# Altium project c195-group-9-vocast-pcb.PrjPcb (part 2 of 2)

## Sheet ESP32.SchDoc
size A; SheetNumber: 3; SheetTotal: 5
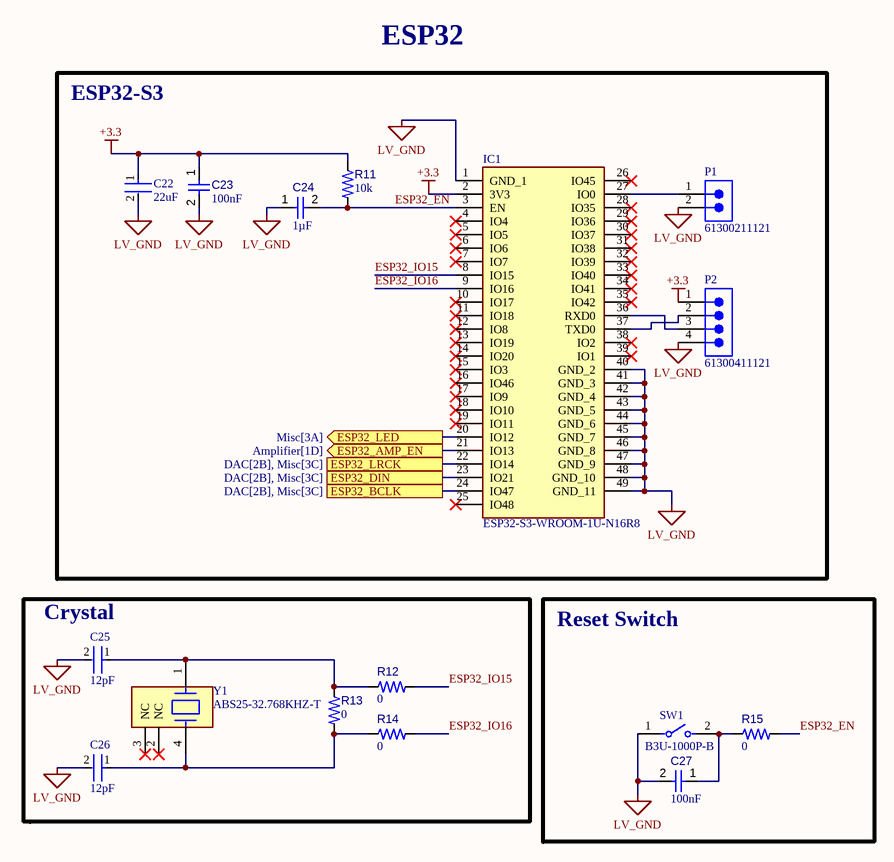
[diagram p2: ESP32.SchDoc]

### Parts
C22  22uF  [FP-GRM188-0_2-IPC_C]
C23  value 100nF  [FP-0603-L_1_6_0_15-W_0_81-IPC_C]  (hidden comment: 06035C104K4T2A)
C24  value 1µF  [CAPC0603(1608)100_L]  (hidden comment: Capacitor 1µF +/-0.1% 25V 0603)
C25  12pF  [FP-C0603C-CF-MFG]
C26  12pF  [FP-C0603C-CF-MFG]
C27  value 100nF  [FP-0603-L_1_6_0_15-W_0_81-IPC_C]  (hidden comment: 06035C104K4T2A)
IC1  ESP32-S3-WROOM-1U-N16R8  [ESP32S3WROOM1UN16R8]
P1  61300211121  [61300211121]
P2  61300411121  [61300411121]
R11  value 10k  [FP-CRCW0603-e3-IPC_C]  (hidden comment: CRCW060310K0JNEA)
R12  value 0  [RESC0603(1608)_L]  (hidden comment: Jumper 0603)
R13  value 0  [RESC0603(1608)_L]  (hidden comment: Jumper 0603)
R14  value 0  [RESC0603(1608)_L]  (hidden comment: Jumper 0603)
R15  value 0  [RESC0603(1608)_L]  (hidden comment: Jumper 0603)
SW1  B3U-1000P-B  [FP-B3U-1000P-B-MFG]
Y1  ABS25-32.768KHZ-T  [FP-ABS25-MFG]

### Blocks framed on the sheet
ESP32-S3: C22-C24 IC1 P1 P2 R11
Crystal: C25 C26 R12-R14 Y1
Reset Switch: C27 R15 SW1

### Ports
ESP32_AMP_EN (out, see Amplifier[1D]), ESP32_BCLK (see DAC[2B], Misc[3C]), ESP32_DIN (see DAC[2B], Misc[3C]), ESP32_LED (out, see Misc[3A]), ESP32_LRCK (see DAC[2B], Misc[3C])

### Nets
+3.3: C22.1 C23.1 IC1.2(3V3) P2.1 R11.1
LV_GND: C22.2 C23.2 C24.1 C25.2 C26.2 C27.2 IC1.1(GND_1) IC1.40(GND_2) IC1.41(GND_3) IC1.42(GND_4) IC1.43(GND_5) IC1.44(GND_6) IC1.45(GND_7) IC1.46(GND_8) IC1.47(GND_9) IC1.48(GND_10) IC1.49(GND_11) P1.2 P2.4 SW1.1  [project net TPA311_AGND]
ESP32_EN: C24.2 IC1.3(EN) R11.2 R15.2
ESP32_IO15: IC1.8(IO15) R12.2
ESP32_IO16: IC1.9(IO16) R14.2
NetC25_1: C25.1 R12.1 R13.1 Y1.1
NetC26_1: C26.1 R13.2 R14.1 Y1.4
NetC27_1: C27.1 R15.1 SW1.2
NetIC1_20: IC1.20(IO12) ; port ESP32_LED
NetIC1_21: IC1.21(IO13) ; port ESP32_AMP_EN
NetIC1_22: IC1.22(IO14) ; port ESP32_LRCK
NetIC1_23: IC1.23(IO21) ; port ESP32_DIN
NetIC1_24: IC1.24(IO47) ; port ESP32_BCLK
NetIC1_27: IC1.27(IO0) P1.1
NetIC1_36: IC1.36(RXD0) P2.3
NetIC1_37: IC1.37(TXD0) P2.2

Not connected (* = marked no-connect by the designer): IC1 4(IO4)* 5(IO5)* 6(IO6)* 7(IO7)* 10(IO17)* 11(IO18)* 12(IO8)* 13(IO19)* 14(IO20)* 15(IO3)* 16(IO46)* 17(IO9)* 18(IO10)* 19(IO11)* 25(IO48)* 26(IO45)* 28(IO35)* 29(IO36)* 30(IO37)* 31(IO38)* 32(IO39)* 33(IO40)* 34(IO41)* 35(IO42)* 38(IO2)* 39(IO1)*; Y1 2(NC)* 3(NC)*

### Notes on the sheet
- ESP32

### Library data of the parts
C22 = CMP-2000-06337-3: Chip Multilayer Ceramic Capacitors for General Purpose, 0603, 22uF, X5R, 15%, 20%, 10V; Tolerance: 20%; Weight: 0.000222oz; Material: Ceramic; Depth: 0.8mm; Length: 1.6mm; Termination: SMD/SMT; Capacitance: 22uF; Packaging: Tape and Reel; Width: 0.8mm; Voltage Rating: 10V; Case Code (Imperial): 0603; Mount: Surface Mount; Voltage Rating (DC): 10V; Case/Package: 0603; Thickness: 0.039inch; REACH SVHC: No SVHC; Dielectric: X5R; Height: 0.8mm; Package Quantity: 4000; Case Code (Metric): 1608; Min Operating Temperature: -55°C; Lead Free: Lead Free; Max Operating Temperature: 85°C
C23 C27 = CMP-001-00085-1: Ceramic Capacitor, Multilayer, Ceramic, 50V, 10% +Tol, 10% -Tol, X7R, 15% TC, 0.1uF, Surface Mount, 0603; RoHS Compliant: Yes; Pins: 2; Capacitor Type: Ceramic; Min Operating Temperature: -55°C; Case/Package: 0603; Mounting Technology: Surface Mount; Max Operating Temperature: 125°C
C24 = CMP-001-00055-4: Chip Capacitor, 1µF +/-0.1%, 25V, 0603, Thickness 1 mm; Tolerance: 20%; Min Operating Temperature: -55°C; Max Operating Temperature: 85°C; Voltage Rating: 25V; Mounting Technology: SMT; Case/Package: 0603; Pins: 2
C25 C26 = CMP-2006-03703-3: Ceramic Capacitor 12Pf 50V, C0G, 5%, 0603, Full Reel; Manufacturer: KEMET; Manufacturer Part Number: C0603C120J5GACTU; Automotive Grade: Grade 1; Temperature Coefficient: 30ppm/°C; Tolerance: 0.05; Temperature Range High: +125°C; Temperature Characteristic: C0G; Temperature Range Low: -55°C; Voltage Rating: 50 V; Mouser Description: Ceramic Capacitor 12Pf 50V, C0G, 5%, 0603, Full Reel; Package: C0603C-CF; Temperature: -55°C to +125°C; Device Class L3: Ceramic Capacitors; Value: 12 pF; Material: Ceramic; Lead Free: Yes; ComponentLink2URL: https://api.kemet.com/component-edge/download/datasheet/C0603C100J5GACAUTO.pdf; Category: Cap; Capacitance: 12 pF; ComponentLink2Description: Datasheet; Device Class L1: Passive Components; Height: 0.87mm; Device Class L2: Capacitors; Digikey Description: Ceramic Capacitor 12Pf 50V, C0G, 5%, 0603, Full Reel; RoHS: TRUE; Octopart: https://octopart.com/c0603c120j5gactu-kemet-108780; Automotive: Yes
IC1 = ESP32-S3-WROOM-1U-N16R8: Integrated Circuit; Manufacturer_Name: Espressif Systems; Datasheet Link: https://www.espressif.com/sites/default/files/documentation/esp32-s3-wroom-1_wroom-1u_datasheet_en.pdf; Height: 3.35mm; Manufacturer_Part_Number: ESP32-S3-WROOM-1U-N16R8; Mouser Part Number: 356-ESP32S3WM1UN16R8; Mouser Price/Stock: https://www.mouser.co.uk/ProductDetail/Espressif-Systems/ESP32-S3-WROOM-1U-N16R8?qs=Li%252BoUPsLEns6V0Pr5KRJtw%3D%3D
P1 = CMP-1712-00002-6: NexarPartId: 20081794; Number of Contacts: 2; Pitch: 2.54mm; Connector Type: Male Pin; Voltage Rating: 250V; Current Rating: 3A; Gender: Male; Contact Resistance: 20mΩ; Height: 8.94mm; Lead Free: Lead Free; Number of Pins: 2; Termination: Through Hole; RoHS: Compliant; Lead Pitch: 2.54mm; REACH SVHC: No SVHC; Housing Material: PBT; Contact Mating Length: 5.9944mm; Min Operating Temperature: -40°C; Orientation: Vertical; Contact Material: Copper; Contact Gender: Male; Max Operating Temperature: 125°C; Number of Rows: 1; Number of Positions: 2; Packaging: Bulk; Contact Plating: Gold; Mount: Through Hole; Color: Black; Operating Supply Voltage: 250V
P2 = CMP-1502-01064-3: NexarPartId: 32855522; Operating Supply Voltage: 250V; Pitch: 2.54mm; Contact Resistance: 20mΩ; Number of Positions: 4; Current Rating: 3A; Connector Type: Male Pin; Gender: Male; Contact Plating: Gold; Height: 8.89mm; Lead Pitch: 2.54mm; Lead Free: Lead Free; Contact Mating Length: 5.9944mm; Number of Rows: 1; Termination: Solder; Packaging: Bulk; REACH SVHC: Unknown; Min Operating Temperature: -40°C; RoHS: Compliant; Number of Contacts: 4; Voltage Rating: 250V; Color: Black; Max Operating Temperature: 105°C; Contact Material: Copper; Mount: Through Hole; Orientation: Vertical; Number of Pins: 4
R11 = CMP-009-00197-4: Fixed Resistor, Metal Glaze/thick Film, 0.1W, 10000ohm, 75V, 5% +/-Tol, 200ppm/Cel, Surface Mount, 0603; Power: 100mW; Mounting Technology: Surface Mount; Tolerance: 5%; RoHS Compliant: Yes; Pins: 2; Max Operating Temperature: 155°C; Min Operating Temperature: -55°C; Case/Package: 0603
R12-R15 = CMP-009-00175-6: Pins: 2; Case/Package: 0603; Min Operating Temperature: -55°C; Max Operating Temperature: 155°C
SW1 = CMP-08834-000005-1: SWITCH TACTILE SPST-NO 0.05A 12V; Manufacturer: Omron; Operating Force: 1.5N; Contact Current Rating: 50mA; Contact Resistance: 100mΩ; Electromechanical Life: 200000Cycles; Height: 1.75mm; Device Class L2: Switches; Temperature Range High: +70°C; Digikey Description: SWITCH TACTILE SPST-NO 0.05A 12V; Throw Configuration: SPST-NO; Ambient Temperature Range High: +70°C; Temperature: -25°C to +70°C; Lead Free: Yes; ComponentLink2URL: https://omronfs.omron.com/en_US/ecb/products/pdf/en-b3u.pdf; Device Class L3: Tactile Switches; Manufacturer Part Number: B3U-1000P-B; Ambient Temperature Range Low: -25°C; Mount: Surface Mount; Automotive: No; Mouser Description: Tactile Switches Top Actuated with boss w/o ground; Octopart: https://octopart.com/b3u-1000p-b-omron-1057356; RoHS: TRUE; Package: 0; Device Class L1: Electromechanical; Voltage Rating Dc: 12V; Category: Switch; Temperature Range Low: -25°C; ComponentLink2Description: Datasheet
Y1 = CMP-2000-05037-2: CRYSTAL 32.7680KHZ 12.5PF SMD; ESR (Equivalent Series Resistance): 50kR; Tolerance: 20ppm; Width: 3.8mm; REACH SVHC: No SVHC; Load Capacitance: 12.5pF; Case/Package: SMD/SMT; Radiation Hardening: No; Series: ABS25; Number of Pins: 4; Mount: Surface Mount; RoHS Compliant: Yes; Packaging: Tape and Reel; Termination: SMD/SMT; Frequency Tolerance: 20ppm; Lead Free: Lead Free; Package Quantity: 1000; Min Operating Temperature: -40°C; Height: 0.098inch; Length: 8mm; Frequency: 32.768kHz; Max Operating Temperature: 85°C; Series Resistance: 50kR; Operating Frequency: 32.768 kHz; Depth: 3.8mm

## Sheet DAC.SchDoc
size A; SheetNumber: 4; SheetTotal: 5
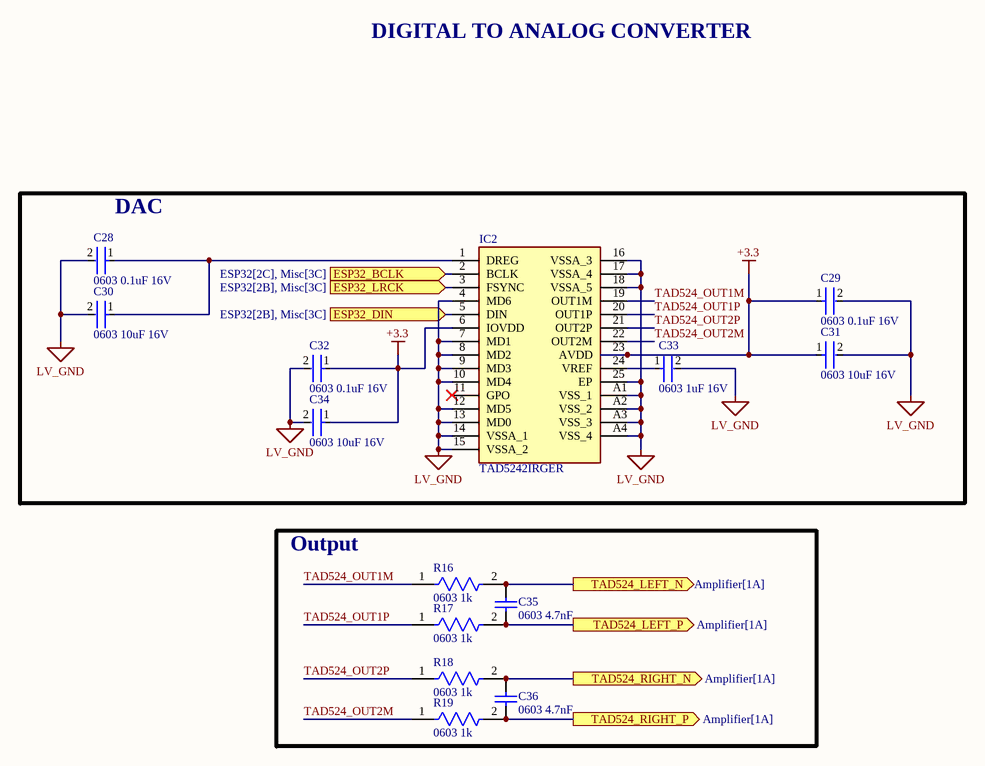
[diagram p3: DAC.SchDoc]

### Parts
C28  0603 0.1uF 16V  [FP-CC0603-DA-MFG]
C29  0603 0.1uF 16V  [FP-CC0603-DA-MFG]
C30  0603 10uF 16V  [FP-0603-L_1_6_0_2-W_0_8_0-MFG]
C31  0603 10uF 16V  [FP-0603-L_1_6_0_2-W_0_8_0-MFG]
C32  0603 0.1uF 16V  [FP-CC0603-DA-MFG]
C33  0603 1uF 16V  [FP-CC0603-DA-MFG]
C34  0603 10uF 16V  [FP-0603-L_1_6_0_2-W_0_8_0-MFG]
C35  0603 4.7nF  [CAPC1608X90X35ML10T15]
C36  0603 4.7nF  [CAPC1608X90X35ML10T15]
IC2  TAD5242IRGER  [TAD5242IRGER]
R16  0603 1k  [FP-AC0603-IPC_B]
R17  0603 1k  [FP-AC0603-IPC_B]
R18  0603 1k  [FP-AC0603-IPC_B]
R19  0603 1k  [FP-AC0603-IPC_B]

### Blocks framed on the sheet
DAC: C28-C34 IC2
Output: C35 C36 R16-R19

### Ports
ESP32_BCLK (in, see ESP32[2C], Misc[3C]), ESP32_DIN (in, see ESP32[2B], Misc[3C]), ESP32_LRCK (in, see ESP32[2B], Misc[3C]), TAD524_LEFT_N (out, see Amplifier[1A]), TAD524_LEFT_P (out, see Amplifier[1A]), TAD524_RIGHT_N (out, see Amplifier[1A]), TAD524_RIGHT_P (out, see Amplifier[1A])

### Nets
+3.3: C29.1 C31.1 C32.1 C34.1 IC2.6(IOVDD) IC2.23(AVDD)
LV_GND: C28.2 C29.2 C30.2 C31.2 C32.2 C33.2 C34.2 IC2.4(MD6) IC2.7(MD1) IC2.8(MD2) IC2.9(MD3) IC2.10(MD4) IC2.12(MD5) IC2.13(MD0) IC2.14(VSSA_1) IC2.15(VSSA_2) IC2.16(VSSA_3) IC2.17(VSSA_4) IC2.18(VSSA_5) IC2.25(EP) IC2.A1(VSS_1) IC2.A2(VSS_2) IC2.A3(VSS_3) IC2.A4(VSS_4)  [project net TPA311_AGND]
TAD524_OUT1M: IC2.19(OUT1M) R16.1
TAD524_OUT1P: IC2.20(OUT1P) R17.1
TAD524_OUT2M: IC2.22(OUT2M) R19.1
TAD524_OUT2P: IC2.21(OUT2P) R18.1
NetC1_1: C35.2 R17.2 ; port TAD524_LEFT_P
NetC3_1: C35.1 R16.2 ; port TAD524_LEFT_N
NetC5_1: C36.2 R19.2 ; port TAD524_RIGHT_P
NetC6_1: C36.1 R18.2 ; port TAD524_RIGHT_N
NetC28_1: C28.1 C30.1 IC2.1(DREG)
NetC33_1: C33.1 IC2.24(VREF)
NetIC1_22: IC2.3(FSYNC) ; port ESP32_LRCK
NetIC1_23: IC2.5(DIN) ; port ESP32_DIN
NetIC1_24: IC2.2(BCLK) ; port ESP32_BCLK

Not connected (* = marked no-connect by the designer): IC2 11(GPO)*

### Notes on the sheet
- DIGITAL TO ANALOG CONVERTER

### Library data of the parts
C28 C29 C32 = CMP-2000-05002-2: CAP CER 0.1UF 16V X7R 0603; Manufacturer Part Number: CC0603KRX7R7BB104; Manufacturer: YAGEO; Tolerance: 0.1; Value: 100 nF; Temperature Coefficient: 15%; Material: Ceramic; Voltage Rating: 16 V; Package: CC0603-DA; ComponentLink2Description: Datasheet; Octopart: https://octopart.com/cc0603krx7r7bb104-yageo-192941; Temperature Range High: +125°C; Digikey Description: CAP CER 0.1UF 16V X7R 0603; Voltage: 16 V; Device Class L2: Capacitors; Height: 0.9mm; Temperature: -55°C to +125°C; Device Class L1: Passive Components; Device Class L3: Ceramic Capacitors; ComponentLink2URL: http://www.yageo.com/documents/recent/UPY-GPHC_X7R_6.3V-to-50V_18.pdf; Footprint Url: http://www.yageo.com/exep/pages/download/literatures/UPY-C_GEN_24.pdf; RoHS: TRUE; Temperature Range Low: -55°C; Temperature Characteristic: X7R; Lead Free: Yes; Capacitance: 100 nF; Category: Cap; Mouser Description: Multilayer Ceramic Capacitor, CC Series, 0.1 - F, - 10%, X7R, 16 V, 0603 [1608 Metric]; Automotive: No
C30 C31 C34 = CMP-2000-06226-4: Multilayer Ceramic Capacitor 10uF 16V X5R 20% SMD 0603 T/R; Packaging: Tape and Reel; Construction: Flat; Height: 0.8mm; Max Operating Temperature: 85°C; Dielectric: X5R; Case Code (Metric): 1608; Voltage Rating (DC): 16V; Width: 0.031inch; Voltage Rating: 16V; Length: 0.063inch; RoHS Compliant: Yes; Halogen Free: Halogen Free; Case Code (Imperial): 0603; Capacitance: 10uF; Mount: Surface Mount; Thickness: 0.031inch; Tolerance: 20%; Min Operating Temperature: -55°C; Series: M; Termination: SMD/SMT; Case/Package: 0603; Package Quantity: 1
C33 = CMP-03422-000924-1: CAP CER 1UF 16V X7R 0603; Manufacturer: YAGEO; Manufacturer Part Number: CC0603KRX7R7BB105; Tolerance: 0.1; Temperature Coefficient: 15%; Material: Ceramic; Package: CC0603-DA; RoHS: TRUE; Device Class L2: Capacitors; Temperature Characteristic: X7R; Temperature: -55°C to +125°C; Temperature Range Low: -55°C; Automotive: No; ComponentLink2Description: Datasheet; Value: 1 uF; Lead Free: Yes; Capacitance: 1 uF; ComponentLink2URL: http://www.yageo.com/documents/recent/UPY-GPHC_X7R_6.3V-to-50V_18.pdf; Device Class L1: Passive Components; Voltage: 16 V; Octopart: https://octopart.com/cc0603krx7r7bb105-yageo-42271928; Category: Cap; Digikey Description: CAP CER 1UF 16V X7R 0603; Footprint Url: http://www.yageo.com/exep/pages/download/literatures/UPY-C_GEN_24.pdf; Height: 0.9mm; Voltage Rating: 16 V; Temperature Range High: +125°C; Mouser Description: Multilayer Ceramic Capacitor, CC Series, 1 - F, - 10%, X7R, 16 V, 0603 [1608 Metric]; Device Class L3: Ceramic Capacitors
C35 C36 = CMP-2006-02924-1: Part Number: GRM188R71H472KA01D; Manufacturer: Murata
IC2 = TAD5242IRGER: Integrated Circuit; Manufacturer_Name: Texas Instruments; Datasheet Link: https://www.ti.com/lit/ds/symlink/tad5242.pdf?ts=1736249226355&ref_url=https%253A%252F%252Fwww.ti.com%252Fproduct%252FTAD5242; Height: 1mm; Manufacturer_Part_Number: TAD5242IRGER; Mouser Part Number: 595-TAD5242IRGER; Mouser Price/Stock: https://www.mouser.co.uk/ProductDetail/Texas-Instruments/TAD5242IRGER?qs=%252BXxaIXUDbq07iiss%252B1zA7A%3D%3D
R16-R19 = CMP-2000-04828-3: RES 1kΩ 1.00% 0.1W 0603; Voltage Rating: 50V; Power Rating: 100mW; Tolerance: 1%; Temperature Coefficient: 100ppm/°C; Resistance: 1kR; Depth: 0.8mm; Case/Package: 0603; Size Code: 0603; Case Code (Metric): 1608; Height: 0.022inch; Series: AC; Width: 0.031inch; Construction: Rectangular; Length: 0.063inch; Case Code (Imperial): 0603; Package Quantity: 1; RoHS Compliant: Yes; Features: Moisture Resistant; Resistor Type: Thick Film; Max Power Dissipation: 100mW; Packaging: Tape and Reel; Termination: SMD/SMT; Ratings: AEC-Q200; Max Operating Temperature: 155°C; Min Operating Temperature: -55°C; Military Standard: Not; Lead Free: Lead Free; Number of Terminations: 2

## Sheet Amplifier.SchDoc
size A; SheetNumber: 5; SheetTotal: 5
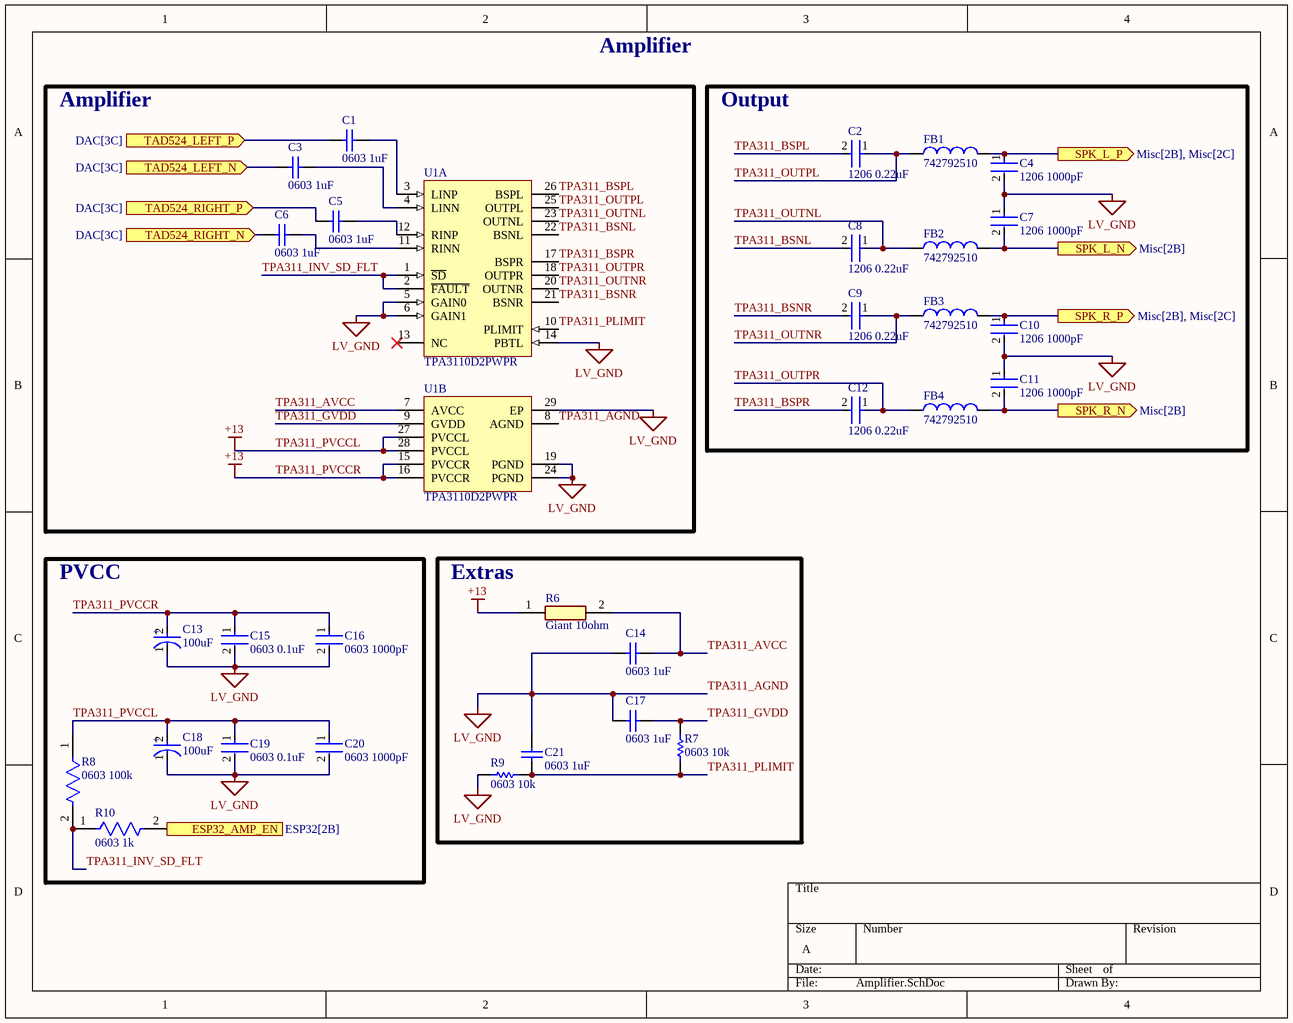
[diagram p4: Amplifier.SchDoc]

### Parts
C1  0603 1uF  [CAPC1608X87X35LL15T15]
C2  1206 0.22uF  [FP-C1206C-EB-MFG]
C3  0603 1uF  [CAPC1608X87X35LL15T15]
C4  1206 1000pF  [FP-C1206C-EB-MFG]
C5  0603 1uF  [CAPC1608X87X35LL15T15]
C6  0603 1uF  [CAPC1608X87X35LL15T15]
C7  1206 1000pF  [FP-C1206C-EB-MFG]
C8  1206 0.22uF  [FP-C1206C-EB-MFG]
C9  1206 0.22uF  [FP-C1206C-EB-MFG]
C10  1206 1000pF  [FP-C1206C-EB-MFG]
C11  1206 1000pF  [FP-C1206C-EB-MFG]
C12  1206 0.22uF  [FP-C1206C-EB-MFG]
C13  100uF  [FP-RAD-TH-D_8_0_5-L_11_5-MFG]
C14  0603 1uF  [CAPC1608X87X35LL15T15]
C15  0603 0.1uF  [FP-C0603C-CF-MFG]
C16  0603 1000pF  [FP-C0603C-CF-MFG]
C17  0603 1uF  [CAPC1608X87X35LL15T15]
C18  100uF  [FP-RAD-TH-D_8_0_5-L_11_5-MFG]
C19  0603 0.1uF  [FP-C0603C-CF-MFG]
C20  0603 1000pF  [FP-C0603C-CF-MFG]
C21  0603 1uF  [CAPC1608X87X35LL15T15]
FB1  742792510  [WE-CBF_1812_L4.5W3.2H1.5_HC]
FB2  742792510  [WE-CBF_1812_L4.5W3.2H1.5_HC]
FB3  742792510  [WE-CBF_1812_L4.5W3.2H1.5_HC]
FB4  742792510  [WE-CBF_1812_L4.5W3.2H1.5_HC]
R6  Giant 10ohm  [TO508P350X1040X2030-2P]
R7  0603 10k  [RESC1609X55X30LL15T15]
R8  0603 100k  [FP-RC0603-0_55-MFG]
R9  0603 10k  [RESC1609X55X30LL15T15]
R10  0603 1k  [FP-AC0603-IPC_B]
U1  TPA3110D2PWPR  [TI-PWP28-5720X1950TP_L]  (parts A,B of 2)

### Blocks framed on the sheet
Amplifier: C1 C3 C5 C6 U1
Output: C2 C4 C7-C12 FB1-FB4
PVCC: C13 C15 C16 C18-C20 R8 R10
Extras: C14 C17 C21 R6 R7 R9

### Ports
ESP32_AMP_EN (in, see ESP32[2B]), SPK_L_N (out, see Misc[2B]), SPK_L_P (out, see Misc[2B], Misc[2C]), SPK_R_N (out, see Misc[2B]), SPK_R_P (out, see Misc[2B], Misc[2C]), TAD524_LEFT_N (in, see DAC[3C]), TAD524_LEFT_P (in, see DAC[3C]), TAD524_RIGHT_N (in, see DAC[3C]), TAD524_RIGHT_P (in, see DAC[3C])

### Nets
TPA311_AGND: C4.2 C7.1 C10.2 C11.1 C13.1(C) C14.1 C15.2 C16.2 C17.1 C18.1(C) C19.2 C20.2 C21.1 R9.1 U1.5(GAIN0) U1.6(GAIN1) U1.8(AGND) U1.14(PBTL) U1.19(PGND) U1.24(PGND) U1.29(EP)  [also labelled LV_GND]
TPA311_PVCCL: C13.2(A) C15.1 C16.1 C18.2(A) C19.1 C20.1 R6.1 R8.1 U1.15(PVCCR) U1.16(PVCCR) U1.27(PVCCL) U1.28(PVCCL)  [also labelled +13, TPA311_PVCCR]
TPA311_AVCC: C14.2 R6.2 U1.7(AVCC)
TPA311_BSNL: C8.2 U1.22(BSNL)
TPA311_BSNR: C9.2 U1.21(BSNR)
TPA311_BSPL: C2.2 U1.26(BSPL)
TPA311_BSPR: C12.2 U1.17(BSPR)
TPA311_GVDD: C17.2 R7.1 U1.9(GVDD)
TPA311_INV_SD_FLT: R8.2 R10.1 U1.1(~{SD}) U1.2(~{FAULT})
TPA311_OUTNL: C8.1 FB2.1 U1.23(OUTNL)
TPA311_OUTNR: C9.1 FB3.1 U1.20(OUTNR)
TPA311_OUTPL: C2.1 FB1.1 U1.25(OUTPL)
TPA311_OUTPR: C12.1 FB4.1 U1.18(OUTPR)
TPA311_PLIMIT: C21.2 R7.2 R9.2 U1.10(PLIMIT)
NetC1_1: C1.1 ; port TAD524_LEFT_P
NetC1_2: C1.2 U1.3(LINP)
NetC3_1: C3.1 ; port TAD524_LEFT_N
NetC3_2: C3.2 U1.4(LINN)
NetC4_1: C4.1 FB1.2 ; port SPK_L_P
NetC5_1: C5.1 ; port TAD524_RIGHT_P
NetC5_2: C5.2 U1.12(RINP)
NetC6_1: C6.1 ; port TAD524_RIGHT_N
NetC6_2: C6.2 U1.11(RINN)
NetC7_2: C7.2 FB2.2 ; port SPK_L_N
NetC10_1: C10.1 FB3.2 ; port SPK_R_P
NetC11_2: C11.2 FB4.2 ; port SPK_R_N
NetIC1_21: R10.2 ; port ESP32_AMP_EN

Not connected (* = marked no-connect by the designer): U1 13(NC)*

### Notes on the sheet
- Amplifier
- (in symbol CMP-05427-002079-1) +

### Library data of the parts
C1 C3 C5 C6 C14 C17 C21 = CMP-2006-03713-1: Part Number: C0603C105K3RACTU; Manufacturer: Kemet
C2 C8 C9 C12 = CMP-03020-014280-1: CAP CER 0.22UF 50V X7R 1206; Manufacturer Part Number: C1206C224K5RACTU; Manufacturer: KEMET; Value: 0.22 μF; Automotive Grade: Grade 0; Tolerance: 0.1; Material: Ceramic; Temperature Coefficient: 15%; Octopart: https://octopart.com/c1206c224k5ractu-kemet-99129; Automotive: Yes; ComponentLink2URL: https://content.kemet.com/datasheets/KEM_C1007_X8R_ULTRA_150C_SMD.pdf; Ipc Land Pattern Name: CAPC320160X78; Digikey Description: CAP CER 0.22UF 50V X7R 1206; Voltage Rating: 50 V; RoHS: TRUE; Device Class L3: Ceramic Capacitors; Device Class L2: Capacitors; Device Class L1: Passive Components; Temperature Range Low: -55°C; Temperature: -55°C to +150°C; Temperature Range High: +150°C; ComponentLink2Description: Datasheet; Category: Cap; Height: 0.88mm; Capacitance: 0.22 μF; Temperature Characteristic: X7R; Package: C1206C-EB; Lead Free: Yes
C4 C7 C10 = CMP-03020-011698-1: CAP CER 100PF 100V C0G/NP0 1206; Manufacturer: KEMET; Manufacturer Part Number: C1206C101J1GACTU; Temperature Characteristic: C0G; Temperature Coefficient: 15%; Tolerance: 0.05; Automotive Grade: Grade 0; Material: Ceramic; Temperature Range Low: -55°C; Device Class L3: Ceramic Capacitors; Temperature: -55°C to +150°C; Value: 100 pF; Capacitance: 100 pF; ComponentLink2URL: https://content.kemet.com/datasheets/KEM_C1007_X8R_ULTRA_150C_SMD.pdf; Ipc Land Pattern Name: CAPC320160X78; Mouser Description: Multilayer Ceramic Capacitors MLCC - SMD/SMT 100volts 100pF C0G 5%; Automotive: Yes; Voltage Rating: 100 V; Octopart: https://octopart.com/c1206c101j1gactu-kemet-98729; Height: 0.88mm; RoHS: TRUE; Lead Free: Yes; Device Class L1: Passive Components; Package: C1206C-EB; Digikey Description: CAP CER 100PF 100V C0G/NP0 1206; ComponentLink2Description: Datasheet; Temperature Range High: +150°C; Category: Cap; Device Class L2: Capacitors
C11 = CMP-03020-011698-1: CAP CER 100PF 100V C0G/NP0 1206 / C1206C101J1GACTU; Manufacturer: KEMET; Temperature Characteristic: C0G; Temperature Coefficient: 15%; Tolerance: 0.05; Automotive Grade: Grade 0; Material: Ceramic; Temperature Range Low: -55°C; Device Class L3: Ceramic Capacitors; Temperature: -55°C to +150°C; Value: 1000 pF; Capacitance: 1000 pF; ComponentLink2URL: https://content.kemet.com/datasheets/KEM_C1007_X8R_ULTRA_150C_SMD.pdf; Ipc Land Pattern Name: CAPC320160X78; Mouser Description: Multilayer Ceramic Capacitors MLCC - SMD/SMT 100volts 100pF C0G 5%; Automotive: Yes; Voltage Rating: 100 V; Octopart: https://octopart.com/c1206c101j1gactu-kemet-98729; Height: 0.88mm; RoHS: TRUE; Lead Free: Yes; Device Class L1: Passive Components; Package: C1206C-EB; Digikey Description: CAP CER 100PF 100V C0G/NP0 1206; ComponentLink2Description: Datasheet; Temperature Range High: +150°C; Category: Cap; Manufacturer Part Number: C1206C101J1GACTU; Device Class L2: Capacitors
C13 C18 = CMP-05427-002079-1: Aluminum Electrolytic Capacitors (Radial Lead Type) 100uF ±20% 50V; ESR (Equivalent Series Resistance): 61mR; Lead Diameter: 0.6mm; Ripple Current (AC): 870mA; Life (Hours): 6000Hour; Lead/Base Style: Straight; Height - Seated (Max): 0.512inch; Height: 11.5mm; REACH SVHC: No SVHC; Contact Plating: Tin; Impedance: 61mR; Capacitance: 100uF; Voltage: 50V; Termination: Radial; Series: FR; Voltage Rating: 50V; Lead Pitch: 3.5mm; Diameter: 8mm; Number of Pins: 2; Min Operating Temperature: -40°C; Mount: Through Hole; Ripple Current: 870mA; Radiation Hardening: No; Length: 11.5mm; Max Operating Temperature: 105°C; Construction: RADIAL; Packaging: Bulk; Package Quantity: 200; Case/Package: Radial; RoHS Compliant: Yes; Voltage Rating (DC): 50V; Tolerance: 20%
C15 C19 = CMP-2006-03057-2: CAP CER 0.1UF 25V X7R 0603; Manufacturer Part Number: C0603C104K3RACTU; Manufacturer: KEMET; Value: 0.10 μF; Material: Ceramic; Tolerance: 0.1; Temperature Coefficient: 30ppm/°C; Automotive Grade: Grade 1; Lead Free: Yes; Device Class L3: Ceramic Capacitors; Voltage Rating: 25 V; Digikey Description: CAP CER 0.1UF 25V X7R 0603; Mouser Description: Multilayer Ceramic Capacitors MLCC - SMD/SMT 25volts 0.1uF X7R 10%; Package: C0603C-CF; Temperature Range Low: -55°C; Automotive: Yes; Device Class L2: Capacitors; Octopart: https://octopart.com/c0603c104k3ractu-kemet-127541; ComponentLink2Description: Datasheet; ComponentLink2URL: https://api.kemet.com/component-edge/download/datasheet/C0603C100J5GACAUTO.pdf; Temperature Range High: +125°C; RoHS: TRUE; Device Class L1: Passive Components; Category: Cap; Temperature: -55°C to +125°C; Capacitance: 0.10 μF; Height: 0.87mm; Temperature Characteristic: X7R
C16 C20 = CMP-2006-03010-2: CAP CER 1000PF 25V 5% NP0 0603; Manufacturer: KEMET; Manufacturer Part Number: C0603C102J3GACTU; Value: 1,000 pF; Tolerance: 0.05; Temperature Characteristic: C0G; Temperature Coefficient: 30ppm/°C; Automotive Grade: Grade 1; Material: Ceramic; Category: Cap; Device Class L2: Capacitors; Octopart: https://octopart.com/c0603c102j3gactu-kemet-8375722; Capacitance: 1,000 pF; ComponentLink2URL: https://api.kemet.com/component-edge/download/datasheet/C0603C100J5GACAUTO.pdf; Digikey Description: CAP CER 1000PF 25V 5% NP0 0603; Device Class L3: Ceramic Capacitors; Temperature Range Low: -55°C; Automotive: Yes; RoHS: TRUE; Temperature Range High: +125°C; ComponentLink2Description: Datasheet; Mouser Description: Multilayer Ceramic Capacitors MLCC - SMD/SMT 25volts 1000pF C0G 5%; Lead Free: Yes; Height: 0.87mm; Voltage Rating: 25 V; Temperature: -55°C to +125°C; Device Class L1: Passive Components; Package: C0603C-CF
FB1-FB4 = CMP-0220-00085-2: NexarPartId: 7861697; Impedance: 70Ω; Resistance: 30mΩ; Max DC Current: 3mA; Max Current Rating: 6A; Number of Lines: 1; Test Frequency: 100MHz; Tolerance: 25%; Case Code (Metric): 4532; RoHS: Compliant; Lead Free: Lead Free; Height: 1.5mm; REACH SVHC: Unknown; Case Code (Imperial): 1812; Length: 4.5mm; Min Operating Temperature: -55°C; Width: 3.2mm; Max Operating Temperature: 125°C; Depth: 3.2mm; Termination: SMD/SMT; Material: Ferrite; Packaging: Cut Tape (CT); DC Resistance (DCR): 30mΩ; Current Rating: 6A; Case/Package: SMD/SMT; Weight: 112.008966mg; Mount: Surface Mount
R6 = LTO050F10R00JTE3: Resistor; Manufacturer_Name: Vishay; Datasheet Link: https://componentsearchengine.com/Datasheets/2/LTO050F10R00JTE3.pdf; Height: 3.5mm; Manufacturer_Part_Number: LTO050F10R00JTE3; Mouser Part Number: 72-LTO050F10R00JTE3; Mouser Price/Stock: https://www.mouser.co.uk/ProductDetail/Vishay-Sfernice/LTO050F10R00JTE3?qs=YEvEAkYMKXtbfJC7MrgrfA%3D%3D; Arrow Part Number: LTO050F10R00JTE3; Arrow Price/Stock: https://www.arrow.com/en/products/lto050f10r00jte3/vishay?region=nac
R7 R9 = CMP-1012-00623-3: Chip Resistor, 10 KOhm, +/- 1%, 0.1 W, -55 to 155 degC, 0603 (1608 Metric), RoHS, Tape and Reel; Manufacturer: Panasonic; Voltage Rating: 75V; Case\/Package: 0603; Power Rating: 100mW; Resistance: 10KOhm; Temperature Coefficient: 100ppm\/degreesC; Number of Pins: 2; Package Reference: 603; Depth: 0.8mm; Mount: SurfaceMount; Package Description: 2-Pin Surface Mount Device, Body 1.6 x 0.85 mm; Datasheet Version: 02/2017; Length: 1.6mm; Lead Free: LeadFree; Height: 0.45mm; Number of Terminations: 2; Max Power Dissipation: 100mW; Min Operating Temperature: -55degC; Datasheet URL: https://industrial.panasonic.com/cdbs/www-data/pdf/RDA0000/AOA0000C304.pdf; Termination: SMD/SMT; Case Code (Metric): 1608; Case Code (Imperial): 0603; Tolerance: 1%; Max Operating Temperature: 155degC; RoHSCompliant: true; Voltage Rating (DC): 75V; Radiation Hardening: No; Packaging: TapeandReel; Composition: ThickFilm; Mounting Technology: SurfaceMount; Manufacturer URL: http://www.panasonic.com/; Width: 0.031inch; REACH SVHC: NoSVHC; Contact Plating: Tin; Military Standard: Not; Package Quantity: 1
R8 = CMP-2100-03662-2: RES SMD 100K OHM 1% 1/10W 0603; Voltage Rating (DC): 50V; Resistance: 100kR; Max Power Dissipation: 100mW; Temperature Coefficient: 100ppm/°C; Working Voltage: 75V; Length: 1.6mm; Lead Free: Lead Free; Number of Terminations: 2; Packaging: Tape and Reel; Voltage Rating: 50V; Termination: SMD/SMT; Width: 0.8mm; Resistor Type: Thick Film; Resistance Tolerance: 1%; Features: Moisture Resistant; Height: 0.45mm; Construction: Rectangular; Case/Package: 0603; Military Standard: Not; Case Code (Imperial): 0603; Series: RC; Technology: THICK FILM; Depth: 0.8mm; RoHS Compliant: Yes; REACH SVHC: No SVHC; Min Operating Temperature: -55°C; Case Code (Metric): 1608; Max Operating Temperature: 155°C; Power Rating: 100mW; Number of Pins: 2; Tolerance: 1%
R10 = CMP-2000-04828-3: as R16 on sheet DAC; Depth: 0.8mm; Case/Package: 0603; Size Code: 0603; Case Code (Metric): 1608; Height: 0.022inch; Series: AC; Width: 0.031inch; Construction: Rectangular; Length: 0.063inch; Case Code (Imperial): 0603; Package Quantity: 1; RoHS Compliant: Yes; Features: Moisture Resistant; Resistor Type: Thick Film; Max Power Dissipation: 100mW; Packaging: Tape and Reel; Termination: SMD/SMT; Ratings: AEC-Q200; Max Operating Temperature: 155°C; Min Operating Temperature: -55°C; Military Standard: Not; Lead Free: Lead Free; Number of Terminations: 2
U1 = CMP-0994-00255-1: 15 W Filter-Free Class D Stereo Amplifier with SpeakerGuard(TM), -40 to 85 degC, 28-pin SOP (PWP28), Green (RoHS & no Sb/Br); Manufacturer: Texas Instruments; Power Stage Supply Min(V): 8; Analog Supply Max [V]: 26; Input Type: Analog; Max. Number of Speaker Outputs: 2; SubFamily: Mid/High-Power Amplifier; PackageReference: PWP28-5720X1950TP; Analog Supply Min [V]: 8; ComponentLink1URL: http://www.ti.com/; ComponentLink1Description: Manufacturer URL; PartNumber: TPA3110D2PWPR; PackageDescription: 28-Pin Plastic Small Outline, Body 4.4 x 9.7 mm, Pitch 0.65 mm; PackageVersion: 4073225-6/I, 05/2011; Mounting Technology: Surface Mount; ComponentLink2URL: http://www.ti.com/general/docs/lit/getliterature.tsp?genericPartNumber=TPA3110D2&fileType=pdf; ComponentLink2Description: Datasheet; ComponentLink3URL: http://www.ti.com/litv/pdf/mpds373; Eco-Plan: Green (RoHS & no Sb/Br); Code_JEDEC: MO-153; ComponentLink3Description: Package Specification; DatasheetVersion: SLOS528D

## Nets that join several sheets
+3.3: Misc (R2.1 TP2.TP), Power (F2.2), ESP32 (5 pins), DAC (6 pins)
TPA311_AGND: Misc (5 pins), Power (13 pins), ESP32 (20 pins), DAC (24 pins), Amplifier (21 pins)
TPA311_PVCCL: Misc (R1.1 TP1.TP), Power (F1.2), Amplifier (12 pins)
NetC1_1: DAC (C35.2 R17.2), Amplifier (C1.1)
NetC3_1: DAC (C35.1 R16.2), Amplifier (C3.1)
NetC4_1: Misc (J1.1 R5.2), Amplifier (C4.1 FB1.2)
NetC5_1: DAC (C36.2 R19.2), Amplifier (C5.1)
NetC6_1: DAC (C36.1 R18.2), Amplifier (C6.1)
NetC7_2: Misc (J1.2), Amplifier (C7.2 FB2.2)
NetC10_1: Misc (J2.1 R4.2), Amplifier (C10.1 FB3.2)
NetC11_2: Misc (J2.2), Amplifier (C11.2 FB4.2)
NetIC1_20: Misc (R3.1), ESP32 (IC1.20)
NetIC1_21: ESP32 (IC1.21), Amplifier (R10.2)
NetIC1_22: Misc (TP4.TP), ESP32 (IC1.22), DAC (IC2.3)
NetIC1_23: Misc (TP5.TP), ESP32 (IC1.23), DAC (IC2.5)
NetIC1_24: Misc (TP6.TP), ESP32 (IC1.24), DAC (IC2.2)